# EAGLE design m901-vu-meter (EAGLE 7.5.1)
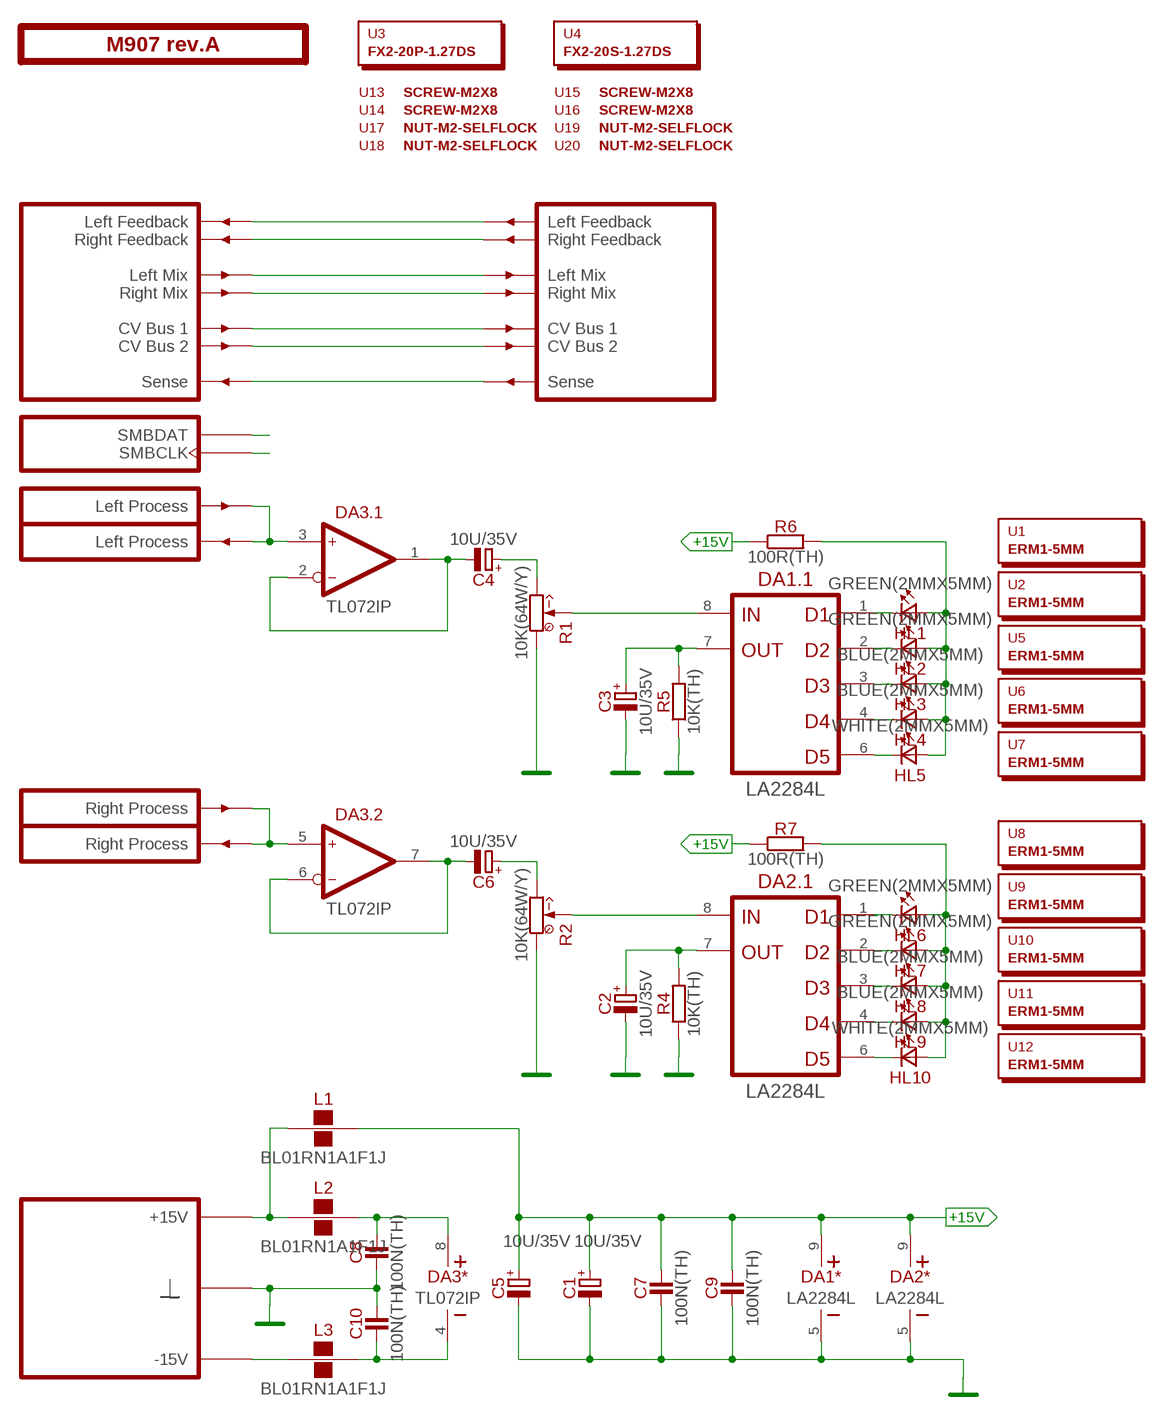
[diagram p0: schematic, sheet 1]

## Parts
C1  10U/35V  [E2-5]
C2  10U/35V  [E2-5]
C3  10U/35V  [E2-5]
C4  10U/35V  [E2-5]
C5  10U/35V  [E2-5]
C6  10U/35V  [E2-5]
C7  100N(TH)  [C050-024X044]
C8  100N(TH)  [C050-024X044]
C9  100N(TH)  [C050-024X044]
C10  100N(TH)  [C050-024X044]
DA1  LA2284L  [SIL9]
DA2  LA2284L  [SIL9]
DA3  TL072IP  [DIP-8]
HL1  GREEN(2MMX5MM)  [LED2X5]
HL2  GREEN(2MMX5MM)  [LED2X5]
HL3  BLUE(2MMX5MM)  [LED2X5]
HL4  BLUE(2MMX5MM)  [LED2X5]
HL5  WHITE(2MMX5MM)  [LED2X5]
HL6  GREEN(2MMX5MM)  [LED2X5]
HL7  GREEN(2MMX5MM)  [LED2X5]
HL8  BLUE(2MMX5MM)  [LED2X5]
HL9  BLUE(2MMX5MM)  [LED2X5]
HL10  WHITE(2MMX5MM)  [LED2X5]
L1  BL01RN1A1F1J  [BL01RN1A]
L2  BL01RN1A1F1J  [BL01RN1A]
L3  BL01RN1A1F1J  [BL01RN1A]
PCB1  M907 rev.A  ST2-BOARD-26  [ST2-BOARD-26]
R1  10K(64W/Y)  [64W]
R2  10K(64W/Y)  [64W]
R4  10K(TH)  [R-0207/10]
R5  10K(TH)  [R-0207/10]
R6  100R(TH)  [R-0207/10]
R7  100R(TH)  [R-0207/10]
U1  ERM1-5MM  [EMPTY]
U2  ERM1-5MM  [EMPTY]
U3  FX2-20P-1.27DS  [EMPTY]
U4  FX2-20S-1.27DS  [EMPTY]
U5  ERM1-5MM  [EMPTY]
U6  ERM1-5MM  [EMPTY]
U7  ERM1-5MM  [EMPTY]
U8  ERM1-5MM  [EMPTY]
U9  ERM1-5MM  [EMPTY]
U10  ERM1-5MM  [EMPTY]
U11  ERM1-5MM  [EMPTY]
U12  ERM1-5MM  [EMPTY]
U13  SCREW-M2X8  [EMPTY]
U14  SCREW-M2X8  [EMPTY]
U15  SCREW-M2X8  [EMPTY]
U16  SCREW-M2X8  [EMPTY]
U17  NUT-M2-SELFLOCK  [EMPTY]
U18  NUT-M2-SELFLOCK  [EMPTY]
U19  NUT-M2-SELFLOCK  [EMPTY]
U20  NUT-M2-SELFLOCK  [EMPTY]

## Nets
+15V [power]: C1.+ C5.+ C7.2 C9.2 DA1.9(*:V+) DA2.9(*:V+) L1.2 R6.1 R7.1
GND: C1.- C2.- C3.- C5.- C7.1 C8.1 C9.1 C10.2 DA1.5(*:V-) DA2.5(*:V-) PCB1.B4'(GND) PCB1.B4(GND) PCB1.B5'(GND) PCB1.B5(GND) PCB1.B6'(GND) PCB1.B6(GND) PCB1.B7'(GND) PCB1.B7(GND) PCB1.B8'(GND) PCB1.B8(GND) R1.1(CCW) R2.1(CCW) R4.1 R5.1
LMIX: PCB1.ALMIX'(LMIX') PCB1.ALMIX(LMIX)
N$1: L1.1 L2.1 PCB1.A+15'(P+15V) PCB1.A+15(P+15V) PCB1.B+15'(P+15V) PCB1.B+15(P+15V)
N$2: PCB1.ALFBK'(LFBK') PCB1.ALFBK(LFBK)
N$3: DA2.8(.1:IN) R2.S(W) R2.S@1(W)
N$4: PCB1.ARFBK'(RFBK') PCB1.ARFBK(RFBK)
N$5: DA1.8(.1:IN) R1.S(W) R1.S@1(W)
N$6: C3.+ DA1.7(.1:OUT) R5.2
N$7: C2.+ DA2.7(.1:OUT) R4.2
N$8: HL1.A HL2.A HL3.A HL4.A HL5.A R6.2
N$9: DA1.1(.1:D1) HL1.K(C)
N$10: DA1.2(.1:D2) HL2.K(C)
N$11: DA1.3(.1:D3) HL3.K(C)
N$12: DA1.4(.1:D4) HL4.K(C)
N$13: DA1.6(.1:D5) HL5.K(C)
N$14: HL6.A HL7.A HL8.A HL9.A HL10.A R7.2
N$15: DA2.1(.1:D1) HL6.K(C)
N$16: PCB1.BSENSE'(SENSE') PCB1.BSENSE(SENSE)
N$17: DA2.2(.1:D2) HL7.K(C)
N$18: DA2.3(.1:D3) HL8.K(C)
N$19: DA2.4(.1:D4) HL9.K(C)
N$20: DA2.6(.1:D5) HL10.K(C)
N$21: C4.+ R1.3(CW)
N$22: C6.+ R2.3(CW)
N$23: DA3.3(.1:IN+) PCB1.BINL(INL) PCB1.BOUTL'(OUTL)
N$24: DA3.5(.2:IN+) PCB1.BINR(INR) PCB1.BOUTR'(OUTR)
N$25: L3.1 PCB1.A-15'(P-15V) PCB1.A-15(P-15V) PCB1.B-15'(P-15V) PCB1.B-15(P-15V)
N$26: C8.2 DA3.8(*:V+) L2.2
N$27: C10.1 DA3.4(*:V-) L3.2
N$28: C4.- DA3.1(.1:OUT) DA3.2(.1:IN-)
N$29: C6.- DA3.6(.2:IN-) DA3.7(.2:OUT)
N$38: PCB1.ASMBDAT'(SMBDAT) PCB1.ASMBDAT(SMBDAT)
N$41: PCB1.ACV1'(CV1') PCB1.ACV1(CV1)
N$42: PCB1.ACV2'(CV2') PCB1.ACV2(CV2)
N$43: PCB1.ASMBCLK'(SMBCLK) PCB1.ASMBCLK(SMBCLK)
RMIX: PCB1.ARMIX'(RMIX') PCB1.ARMIX(RMIX)

## Library data of the parts
C1-C6 = capacitors-electrolytic:?; MOUSER: 647-USW1V100MDD
C7-C10 = capacitors:?; MOUSER: 81-RCER71H104K0A2H3B
DA1 DA2 = ic-utc:LA2284
DA3 = ic-ti:TL072; MOUSER: 595-TL072IP
HL1-HL10 = optoelectronics:?(2MMX5MM)
L1-L3 = inductors:BL01RN1A?; MOUSER: 81-BL01RN1A1F1J
PCB1 = module-footprints:ST2-BOARD-?
R1 R2 = potentiometers:?(64W/Y); MOUSER: 858-64WR10KLF
R4 R5 = resistors:?; MOUSER: 71-RN55D-F-10K
R6 R7 = resistors:?; MOUSER: 71-RN55D-F-100/R
U1 U2 U5-U12 = hardware:?
U3 = hardware:?; MOUSER: 798-FX2-20P-1.27DS71
U4 = hardware:?; MOUSER: 798-FX2-20S-1.27DS71
U13-U20 = hardware:*?

## Board
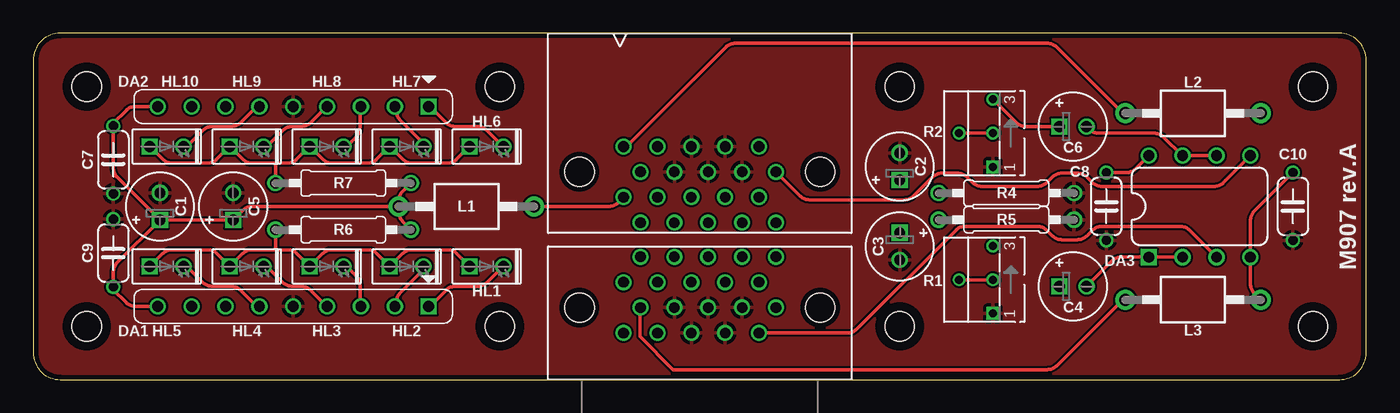
[diagram p1: board, top side]
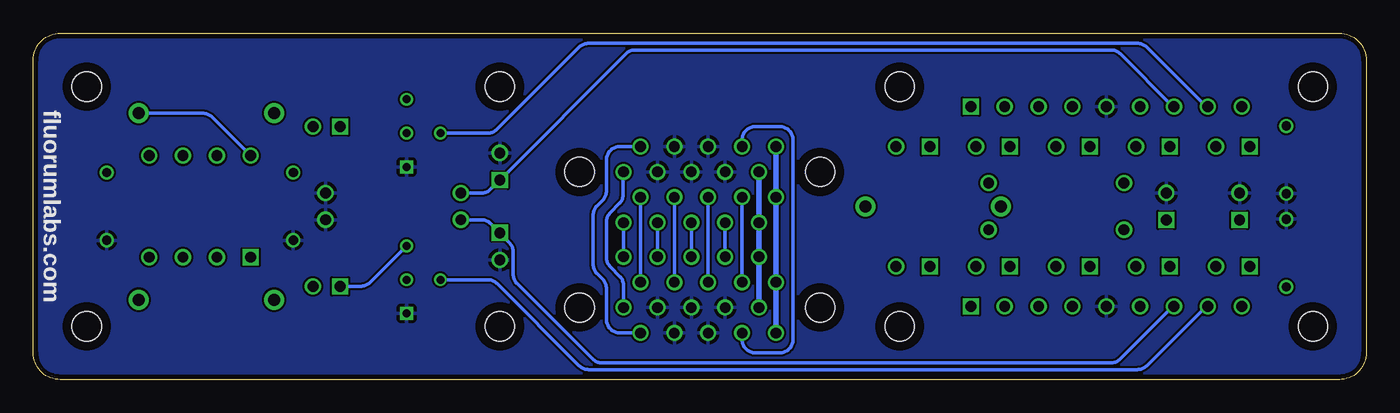
[diagram p2: board, bottom side, seen from below]

Size 100 x 26 mm. Coordinates in mm from the lower left corner, seen from the top.
Outline: 0,24 0,2 arc90 2,0 98,0 arc90 100,2 100,24 arc90 98,26 2,26 arc90 0,24
Copper layers (1*16): Top 0.0356mm / dielectric 1.5011mm / Bottom 0.0356mm
Design rules "sonictrain": minimum track width 6mil, minimum drill 13mil, track to track 6mil, track to pad 6mil, pad to pad 6mil, via to via 6mil, smd to smd 6mil, copper to edge 15mil, drill to drill 6mil, minimum pad ring 7mil, minimum via ring 7mil, stop-mask expansion 3mil, vias tented up to drill 0mil, thermal gap 10mil

### Footprints (pad centres in the part's own frame; a part is rotated, then mirrored left to right if it is on the bottom)
E2-5 = drill 0.813 square: + -1.016,0 | drill 0.813: - 1.016,0
C050-024X044 = drill 0.7: 1 -2.54,0; 2 2.54,0
SIL9 = drill 0.813 square: 1 -10.16,0 | drill 0.813: 2 -7.62,0; 3 -5.08,0; 4 -2.54,0; 5 0,0; 6 2.54,0; 7 5.08,0; 8 7.62,0; 9 10.16,0
DIP-8 = drill 0.813 square: 1 -3.81,-3.81 | drill 0.813: 2 -1.27,-3.81; 3 1.27,-3.81; 4 3.81,-3.81; 5 3.81,3.81; 6 1.27,3.81; 7 -1.27,3.81; 8 -3.81,3.81
LED2X5 = drill 0.813 square: A -1.27,0 | drill 0.813: K 1.27,0
BL01RN1A = drill 0.9 pad 1.5: 1 -5.08,0; 2 5.08,0
ST2-BOARD-26 = drill 0.8: A+15 44.285,7.31; A+15' 44.285,13.69; A-15 45.555,9.215; A-15' 45.555,11.785; ACV1 51.905,7.31; ACV1' 51.905,13.69; ACV2 53.175,9.215; ACV2' 53.175,11.785; ALFBK 49.365,7.31; ALFBK' 49.365,13.69; ALMIX 46.825,7.31; ALMIX' 46.825,13.69; ARFBK 50.635,9.215; ARFBK' 50.635,11.785; ARMIX 48.095,9.215; ARMIX' 48.095,11.785; ASMBCLK 55.715,9.215; ASMBCLK' 55.715,11.785; ASMBDAT 54.445,7.31; ASMBDAT' 54.445,13.69; B4 48.095,5.405; B4' 48.095,15.595; B5 49.365,3.5; B5' 49.365,17.5; B6 50.635,5.405; B6' 50.635,15.595; B7 51.905,3.5; B7' 51.905,17.5; B8 53.175,5.405; B8' 53.175,15.595; B+15 44.285,3.5; B+15' 44.285,17.5; B-15 45.555,5.405; B-15' 45.555,15.595; BINL 54.445,3.5; BINR 55.715,5.405; BOUTL' 54.445,17.5; BOUTR' 55.715,15.595; BSENSE 46.825,3.5; BSENSE' 46.825,17.5 | hole 2.2: 4,4; 4,22; 96,4; 96,22; 35,22; 65,22; 65,4; 35,4; 59.025,5.405; 40.975,5.405; 40.975,15.595; 59.025,15.595
64W = drill 0.6 square: 1 2.54,0 | drill 0.6: 3 -2.54,0; S 0,-2.54; S@1 0,0
R-0207/10 = drill 0.813: 1 -5.08,0; 2 5.08,0

### Placement (x,y rotation side)
C1  9.5,13 90 top
C2  65,16 90 top
C3  65,10 270 top
C4  78,7 0 top
C5  15,13 90 top
C6  78,19 0 top
C7  6,16.5 90 top
C8  80.5,13 90 top
C9  6,9.5 270 top
C10  94.5,13 270 top
DA1  19.5,5.5 180 top
DA2  19.5,20.5 180 top
DA3  87.5,13 0 top
HL1  34,8.5 0 top
HL2  28,8.5 0 top
HL3  22,8.5 0 top
HL4  16,8.5 0 top
HL5  10,8.5 0 top
HL6  34,17.5 0 top
HL7  28,17.5 0 top
HL8  22,17.5 0 top
HL9  16,17.5 0 top
HL10  10,17.5 0 top
L1  32.5,13 180 top
L2  87,20 0 top
L3  87,6 0 top
PCB1  0,0 0 top
R1  72,7.5 270 top
R2  72,18.5 270 top
R4  73,14 180 top
R5  73,12 180 top
R6  23.25,11.25 180 top
R7  23.25,14.75 180 top
U1  -20,-7 0 top  (outside the outline)
U2  -21,-9 0 top  (outside the outline)
U3  -16.51,80.01 0 top  (outside the outline)
U4  -19.05,80.01 0 top  (outside the outline)
U5  -22,-11 0 top  (outside the outline)
U6  -23,-13 0 top  (outside the outline)
U7  -24,-15 0 top  (outside the outline)
U8  -25,-17 0 top  (outside the outline)
U9  -26,-19 0 top  (outside the outline)
U10  -27,-21 0 top  (outside the outline)
U11  -28,-23 0 top  (outside the outline)
U12  -29,-25 0 top  (outside the outline)
U13  -30,-26.25 0 top  (outside the outline)
U14  -31,-27.5 0 top  (outside the outline)
U15  -32,-28.75 0 top  (outside the outline)
U16  -33,-30 0 top  (outside the outline)
U17  -34,-31.25 0 top  (outside the outline)
U18  -35,-32.5 0 top  (outside the outline)
U19  -36,-33.75 0 top  (outside the outline)
U20  -37,-35 0 top  (outside the outline)

### Tracks (layer width: path | path; a pad name or v marks a point on that pad's centre or on a via)
+15V
  Top 0.254: DA2.9 7.66,20.5 arc45 6.96,20.21 6,19.25 C7.2 6,15.9 arc45 6.29,15.19 C1.+ | DA1.9 7.66,5.5 arc-45 6.96,5.79 6,6.75 C9.2 6,8.07 arc-45 6.29,8.78 C1.+ | L1.2 27.42,13.43 arc-45 27.71,14.13 R7.1 | L1.2 27.42,12.57 arc45 27.71,11.87 R6.1 | L1.2 16.43,13 arc45 15.72,12.71 C5.+ C1.+
GND
  pour Bottom: 98,0 2,0 arc-90 0,2 0,24 arc-90 2,26 98,26 arc-90 100,24 100,2 arc-90
  pour Top: 98,0 2,0 arc-90 0,2 0,24 arc-90 2,26 98,26 arc-90 100,24 100,2 arc-90
LMIX
  Bottom 0.254: PCB1.ALMIX PCB1.ALMIX'
N$1
  Top 0.254: L1.1 43.18,13 arc45 43.89,13.29 PCB1.A+15' | PCB1.B+15' 44.5,17.5 51.96,24.96 arc-45 52.66,25.25 76.09,25.25 arc-45 76.79,24.96 81.75,20 L2.1
  Bottom 0.406: PCB1.B+15' PCB1.A+15' PCB1.A+15 PCB1.B+15
N$2
  Bottom 0.254: PCB1.ALFBK PCB1.ALFBK'
N$3
  Top 0.254: R2.S@1 R2.S
  Bottom 0.254: R2.S 65.91,18.5 arc-45 65.21,18.79 59.04,24.96 arc45 58.34,25.25 17.16,25.25 arc45 16.46,24.96 12,20.5 DA2.8
N$4
  Bottom 0.254: PCB1.ARFBK PCB1.ARFBK'
N$5
  Top 0.254: R1.S@1 R1.S
  Bottom 0.254: DA1.8 12,5.5 16.46,1.04 arc45 17.16,0.75 58.34,0.75 arc45 59.04,1.04 65.21,7.21 arc-45 65.91,7.5 R1.S
N$6
  Bottom 0.254: DA1.7 14.5,5.5 18.46,1.54 arc45 19.16,1.25 57.34,1.25 arc45 58.04,1.54 63.71,7.21 arc45 64,7.91 64,9.59 arc-45 64.29,10.29 65,11 C3.+ 65.69,11.71 arc-45 66.4,12 R5.2
N$7
  Bottom 0.254: DA2.7 14.5,20.5 18.46,24.46 arc-45 19.16,24.75 54.84,24.75 arc-45 55.54,24.46 65,15 C2.+ 65.69,14.29 arc45 66.4,14 R4.2
N$8
  Top 0.254: HL5.A 8.75,8.5 9.71,9.46 arc-45 10.41,9.75 13.07,9.75 arc-45 13.77,9.46 HL4.A 14.75,8.5 15.71,9.46 arc-45 16.41,9.75 18.25,9.75 | 18.25,9.75 19.07,9.75 arc-45 19.77,9.46 HL3.A 20.75,8.5 21.71,9.46 arc-45 22.41,9.75 25.07,9.75 arc-45 25.77,9.46 HL2.A 26.75,8.5 27.71,9.46 arc-45 28.41,9.75 31.07,9.75 arc-45 31.77,9.46 HL1.A | R6.2 18.17,9.83 18.25,9.75
N$9
  Top 0.254: DA1.1 29.75,5.5 30.96,6.71 arc-45 31.66,7 33.34,7 arc45 34.04,7.29 35.25,8.5 HL1.K
N$10
  Top 0.254: DA1.2 27.25,5.5 27.25,5.84 arc-45 27.54,6.54 29.5,8.5 HL2.K
N$11
  Top 0.254: DA1.3 24.5,5.5 24.5,7.09 arc45 24.21,7.79 23.5,8.5 HL3.K
N$12
  Top 0.254: HL4.K 17.5,8.5 18.71,7.29 arc45 19.41,7 20.09,7 arc-45 20.79,6.71 22,5.5 DA1.4
N$13
  Top 0.254: DA1.6 16.75,5.5 15.54,6.71 arc45 14.84,7 13.41,7 arc-45 12.71,7.29 11.5,8.5 HL5.K
N$14
  Top 0.254: HL10.A 8.75,17.5 9.71,16.54 arc45 10.41,16.25 13.07,16.25 arc45 13.77,16.54 HL9.A 14.75,17.5 15.71,16.54 arc45 16.41,16.25 18.25,16.25 | 18.25,16.25 19.07,16.25 arc45 19.77,16.54 HL8.A 20.75,17.5 21.71,16.54 arc45 22.41,16.25 25.07,16.25 arc45 25.77,16.54 HL7.A 26.75,17.5 27.71,16.54 arc45 28.41,16.25 31.07,16.25 arc45 31.77,16.54 HL6.A | R7.2 18.17,16.17 18.25,16.25
N$15
  Top 0.254: DA2.1 29.75,20.5 30.96,19.29 arc45 31.66,19 33.34,19 arc-45 34.04,18.71 35.25,17.5 HL6.K
N$16
  Bottom 0.254: PCB1.BSENSE 46.83,3 arc-90 45.83,2 44,2 arc-90 43,3 43,18 arc-90 44,19 45.83,19 arc-90 46.83,18 PCB1.BSENSE'
N$17
  Top 0.254: DA2.2 27.25,20.5 27.25,20.16 arc45 27.54,19.46 29.5,17.5 HL7.K
N$18
  Top 0.254: DA2.3 24.5,20.5 24.5,18.91 arc-45 24.21,18.21 23.5,17.5 HL8.K
N$19
  Top 0.254: HL9.K 17.5,17.5 18.71,18.71 arc-45 19.41,19 20.09,19 arc45 20.79,19.29 22,20.5 DA2.4
N$20
  Top 0.254: HL10.K 11.5,17.5 12.71,18.71 arc-45 13.41,19 14.84,19 arc45 15.54,19.29 16.75,20.5 DA2.6
N$21
  Bottom 0.254: C4.+ 75.45,7 arc-45 74.75,7.29 R1.3
N$22
  Top 0.254: C6.+ 74.45,19 arc-45 73.75,19.29 R2.3
N$23
  Top 0.254: DA3.3 86.75,11.21 arc45 86.05,11.5 80.16,11.5 arc45 79.46,11.21 79.04,10.79 arc-45 78.34,10.5 77.16,10.5 arc-45 76.46,10.79 76.04,11.21 arc45 75.34,11.5 69.91,11.5 arc45 69.21,11.21 61.79,3.79 arc-45 61.09,3.5 PCB1.BINL
  Bottom 0.254: PCB1.BINL 56,3.5 arc90 57,4.5 57,6.84 arc-45 57.29,7.54 57.71,7.96 arc45 58,8.66 58,12.34 arc45 57.71,13.04 57.29,13.46 arc-45 57,14.16 57,16.5 arc90 56,17.5 PCB1.BOUTL'
N$24
  Top 0.254: DA3.5 89.29,14.79 arc-45 88.59,14.5 80.16,14.5 arc-45 79.46,14.79 79.04,15.21 arc45 78.34,15.5 77.16,15.5 arc45 76.46,15.21 76.04,14.79 arc-45 75.34,14.5 71.16,14.5 arc-45 70.46,14.79 70.04,15.21 arc45 69.34,15.5 68.16,15.5 arc45 67.46,15.21 66.04,13.79 arc-45 65.34,13.5 58.22,13.5 arc-45 57.52,13.79 PCB1.BOUTR'
  Bottom 0.254: PCB1.BINR 55.72,7.05 arc-45 56.01,7.76 56.71,8.46 arc45 57,9.16 57,11.84 arc45 56.71,12.54 56.04,13.21 arc-45 55.75,13.91 55.75,15.56 PCB1.BOUTR'
N$25
  Top 0.254: PCB1.B-15 45.5,5.5 45.5,3.25 48,0.75 76.09,0.75 arc45 76.79,1.04 81.75,6 L3.1
  Bottom 0.406: PCB1.B-15 PCB1.A-15 PCB1.A-15' PCB1.B-15'
N$26
  Top 0.254: C8.2 82.01,15.54 arc45 82.71,15.83 DA3.8
  Bottom 0.254: L2.2 87.29,20 arc45 86.59,19.71 DA3.8
N$27
  Top 0.254: L3.2 91.6,6.48 arc-45 91.31,7.18 DA3.4 91.31,11.94 arc-45 91.6,12.64 C10.1
N$28
  Top 0.254: DA3.2 DA3.1 81.62,9.19 arc45 80.91,8.9 C4.-
N$29
  Top 0.254: DA3.6 DA3.7 86.19,16.81 84.79,18.21 arc45 84.09,18.5 79.93,18.5 arc-45 79.22,18.79 C6.-
N$38
  Bottom 0.254: PCB1.ASMBDAT PCB1.ASMBDAT'
N$41
  Bottom 0.254: PCB1.ACV1 PCB1.ACV1'
N$42
  Bottom 0.254: PCB1.ACV2 PCB1.ACV2'
N$43
  Bottom 0.254: PCB1.ASMBCLK PCB1.ASMBCLK'
RMIX
  Bottom 0.254: PCB1.ARMIX PCB1.ARMIX'